# Altium schematic sheet Sheet1.SchDoc
size A4
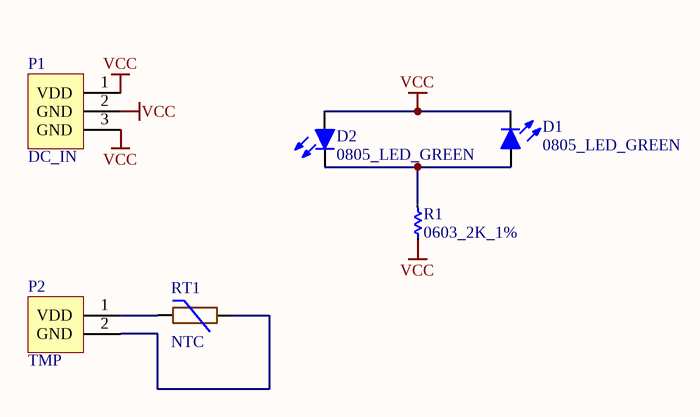
[diagram p0: Sheet1.SchDoc]

## Parts
D1  0805_LED_GREEN  [LED0805G]
D2  0805_LED_GREEN  [LED0805G]
P1  DC_IN  [DC_IN]
P2  TMP  [TMP_IN]
R1  0603_2K_1%  [R0603]
RT1  NTC  [NTC0805]

## Nets
VCC: D1.2(K) D2.1(A) P1.1(VDD) P1.2(GND) P1.3(GND) R1.1
NetD1_1: D1.1(A) D2.2(K) R1.2
NetP2_1: P2.1(VDD) RT1.1
NetP2_2: P2.2(GND) RT1.2

## Library data of the parts
D1 D2 = LED0805
P2 = TMP_IN
R1 = R0603: Resistor; Published: 8-Jun-2000; LatestRevisionDate: 17-Jul-2002; LatestRevisionNote: Re-released for DXP Platform.; PackageReference: AXIAL-0.3; Publisher: Altium Limited
RT1 = NTCG204CH104JT1S